# Altium schematic sheet BatTest.SchDoc
size A3
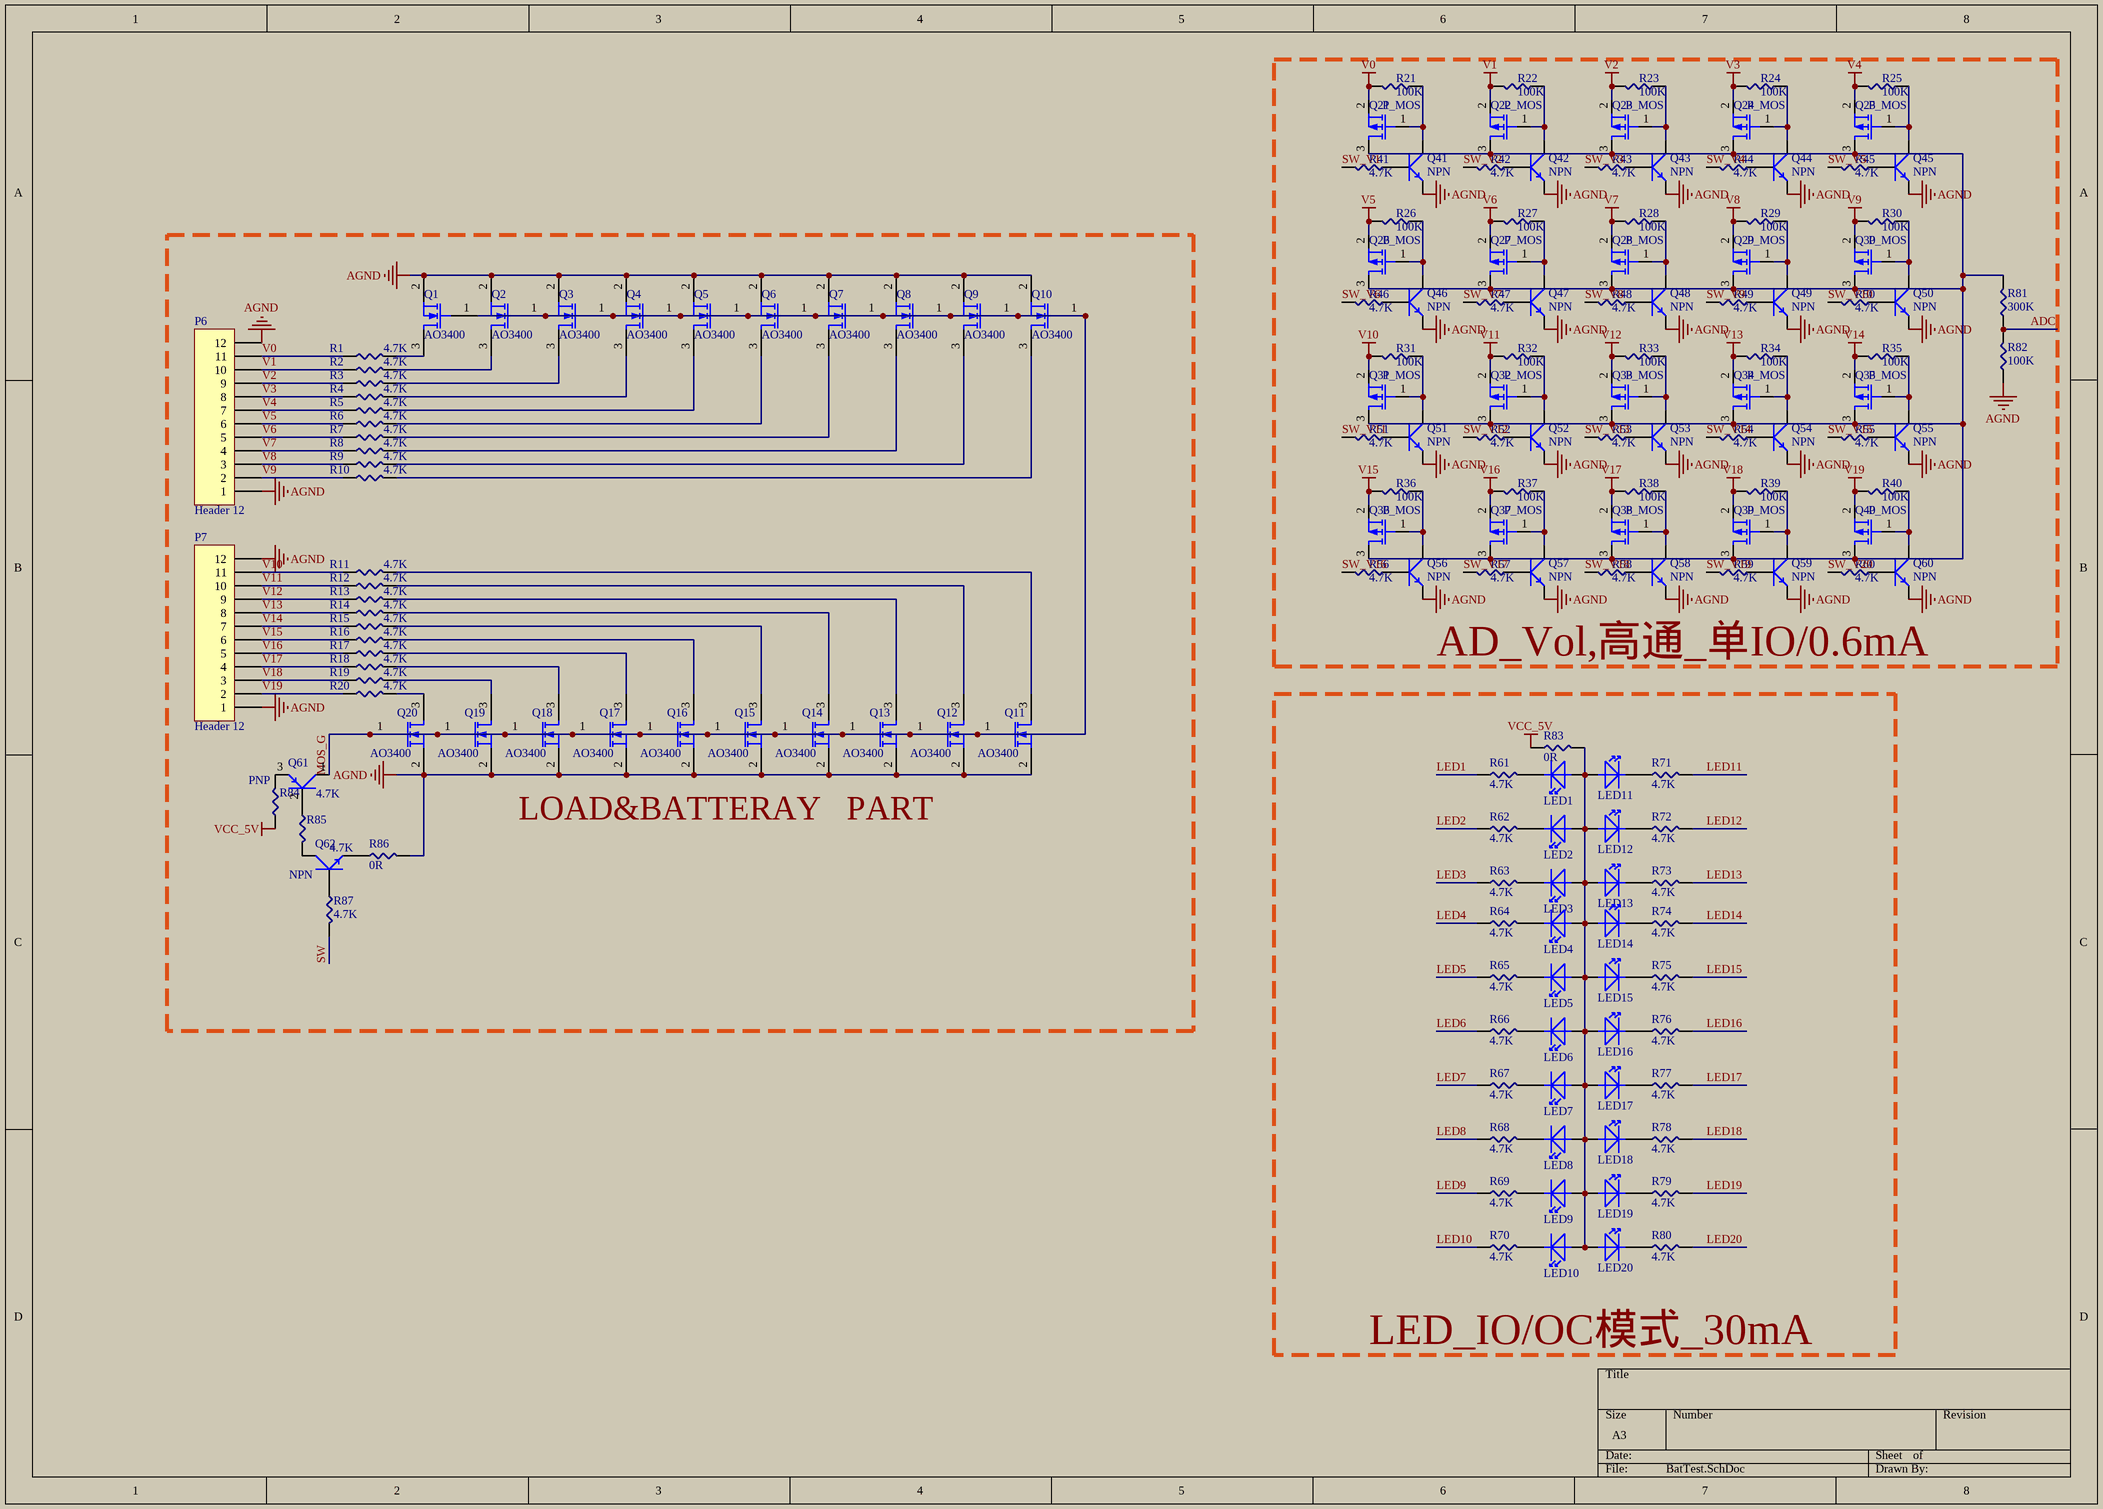
[diagram p0: BatTest.SchDoc]

## Parts
LED1  SMD-LED  [DIODE-0603]  (value not drawn)
LED2  SMD-LED  [DIODE-0603]  (value not drawn)
LED3  SMD-LED  [DIODE-0603]  (value not drawn)
LED4  SMD-LED  [DIODE-0603]  (value not drawn)
LED5  SMD-LED  [DIODE-0603]  (value not drawn)
LED6  SMD-LED  [DIODE-0603]  (value not drawn)
LED7  SMD-LED  [DIODE-0603]  (value not drawn)
LED8  SMD-LED  [DIODE-0603]  (value not drawn)
LED9  SMD-LED  [DIODE-0603]  (value not drawn)
LED10  SMD-LED  [DIODE-0603]  (value not drawn)
LED11  SMD-LED  [DIODE-0603]  (value not drawn)
LED12  SMD-LED  [DIODE-0603]  (value not drawn)
LED13  SMD-LED  [DIODE-0603]  (value not drawn)
LED14  SMD-LED  [DIODE-0603]  (value not drawn)
LED15  SMD-LED  [DIODE-0603]  (value not drawn)
LED16  SMD-LED  [DIODE-0603]  (value not drawn)
LED17  SMD-LED  [DIODE-0603]  (value not drawn)
LED18  SMD-LED  [DIODE-0603]  (value not drawn)
LED19  SMD-LED  [DIODE-0603]  (value not drawn)
LED20  SMD-LED  [DIODE-0603]  (value not drawn)
P6  Header 12  [HDR1X12]
P7  Header 12  [HDR1X12]
Q1  AO3400  [SOT-23-MOS]
Q2  AO3400  [SOT-23-MOS]
Q3  AO3400  [SOT-23-MOS]
Q4  AO3400  [SOT-23-MOS]
Q5  AO3400  [SOT-23-MOS]
Q6  AO3400  [SOT-23-MOS]
Q7  AO3400  [SOT-23-MOS]
Q8  AO3400  [SOT-23-MOS]
Q9  AO3400  [SOT-23-MOS]
Q10  AO3400  [SOT-23-MOS]
Q11  AO3400  [SOT-23-MOS]
Q12  AO3400  [SOT-23-MOS]
Q13  AO3400  [SOT-23-MOS]
Q14  AO3400  [SOT-23-MOS]
Q15  AO3400  [SOT-23-MOS]
Q16  AO3400  [SOT-23-MOS]
Q17  AO3400  [SOT-23-MOS]
Q18  AO3400  [SOT-23-MOS]
Q19  AO3400  [SOT-23-MOS]
Q20  AO3400  [SOT-23-MOS]
Q21  P_MOS  [SOT-23-MOS]
Q22  P_MOS  [SOT-23-MOS]
Q23  P_MOS  [SOT-23-MOS]
Q24  P_MOS  [SOT-23-MOS]
Q25  P_MOS  [SOT-23-MOS]
Q26  P_MOS  [SOT-23-MOS]
Q27  P_MOS  [SOT-23-MOS]
Q28  P_MOS  [SOT-23-MOS]
Q29  P_MOS  [SOT-23-MOS]
Q30  P_MOS  [SOT-23-MOS]
Q31  P_MOS  [SOT-23-MOS]
Q32  P_MOS  [SOT-23-MOS]
Q33  P_MOS  [SOT-23-MOS]
Q34  P_MOS  [SOT-23-MOS]
Q35  P_MOS  [SOT-23-MOS]
Q36  P_MOS  [SOT-23-MOS]
Q37  P_MOS  [SOT-23-MOS]
Q38  P_MOS  [SOT-23-MOS]
Q39  P_MOS  [SOT-23-MOS]
Q40  P_MOS  [SOT-23-MOS]
Q41  value NPN  [SOT-23]  (hidden comment: SMD-TRAN)
Q42  value NPN  [SOT-23]  (hidden comment: SMD-TRAN)
Q43  value NPN  [SOT-23]  (hidden comment: SMD-TRAN)
Q44  value NPN  [SOT-23]  (hidden comment: SMD-TRAN)
Q45  value NPN  [SOT-23]  (hidden comment: SMD-TRAN)
Q46  value NPN  [SOT-23]  (hidden comment: SMD-TRAN)
Q47  value NPN  [SOT-23]  (hidden comment: SMD-TRAN)
Q48  value NPN  [SOT-23]  (hidden comment: SMD-TRAN)
Q49  value NPN  [SOT-23]  (hidden comment: SMD-TRAN)
Q50  value NPN  [SOT-23]  (hidden comment: SMD-TRAN)
Q51  value NPN  [SOT-23]  (hidden comment: SMD-TRAN)
Q52  value NPN  [SOT-23]  (hidden comment: SMD-TRAN)
Q53  value NPN  [SOT-23]  (hidden comment: SMD-TRAN)
Q54  value NPN  [SOT-23]  (hidden comment: SMD-TRAN)
Q55  value NPN  [SOT-23]  (hidden comment: SMD-TRAN)
Q56  value NPN  [SOT-23]  (hidden comment: SMD-TRAN)
Q57  value NPN  [SOT-23]  (hidden comment: SMD-TRAN)
Q58  value NPN  [SOT-23]  (hidden comment: SMD-TRAN)
Q59  value NPN  [SOT-23]  (hidden comment: SMD-TRAN)
Q60  value NPN  [SOT-23]  (hidden comment: SMD-TRAN)
Q61  PNP  [SOT-23]
Q62  value NPN  [SOT-23]  (hidden comment: SMD-TRAN)
R1  value 4.7K  [C1206]  (hidden comment: Resistance)
R2  value 4.7K  [C1206]  (hidden comment: Resistance)
R3  value 4.7K  [C1206]  (hidden comment: Resistance)
R4  value 4.7K  [C1206]  (hidden comment: Resistance)
R5  value 4.7K  [C1206]  (hidden comment: Resistance)
R6  value 4.7K  [C1206]  (hidden comment: Resistance)
R7  value 4.7K  [C1206]  (hidden comment: Resistance)
R8  value 4.7K  [C1206]  (hidden comment: Resistance)
R9  value 4.7K  [C1206]  (hidden comment: Resistance)
R10  value 4.7K  [C1206]  (hidden comment: Resistance)
R11  value 4.7K  [C1206]  (hidden comment: Resistance)
R12  value 4.7K  [C1206]  (hidden comment: Resistance)
R13  value 4.7K  [C1206]  (hidden comment: Resistance)
R14  value 4.7K  [C1206]  (hidden comment: Resistance)
R15  value 4.7K  [C1206]  (hidden comment: Resistance)
R16  value 4.7K  [C1206]  (hidden comment: Resistance)
R17  value 4.7K  [C1206]  (hidden comment: Resistance)
R18  value 4.7K  [C1206]  (hidden comment: Resistance)
R19  value 4.7K  [C1206]  (hidden comment: Resistance)
R20  value 4.7K  [C1206]  (hidden comment: Resistance)
R21  value 100K  [R_0603]  (hidden comment: Resistance)
R22  value 100K  [R_0603]  (hidden comment: Resistance)
R23  value 100K  [R_0603]  (hidden comment: Resistance)
R24  value 100K  [R_0603]  (hidden comment: Resistance)
R25  value 100K  [R_0603]  (hidden comment: Resistance)
R26  value 100K  [R_0603]  (hidden comment: Resistance)
R27  value 100K  [R_0603]  (hidden comment: Resistance)
R28  value 100K  [R_0603]  (hidden comment: Resistance)
R29  value 100K  [R_0603]  (hidden comment: Resistance)
R30  value 100K  [R_0603]  (hidden comment: Resistance)
R31  value 100K  [R_0603]  (hidden comment: Resistance)
R32  value 100K  [R_0603]  (hidden comment: Resistance)
R33  value 100K  [R_0603]  (hidden comment: Resistance)
R34  value 100K  [R_0603]  (hidden comment: Resistance)
R35  value 100K  [R_0603]  (hidden comment: Resistance)
R36  value 100K  [R_0603]  (hidden comment: Resistance)
R37  value 100K  [R_0603]  (hidden comment: Resistance)
R38  value 100K  [R_0603]  (hidden comment: Resistance)
R39  value 100K  [R_0603]  (hidden comment: Resistance)
R40  value 100K  [R_0603]  (hidden comment: Resistance)
R41  value 4.7K  [R_0603]  (hidden comment: Resistance)
R42  value 4.7K  [R_0603]  (hidden comment: Resistance)
R43  value 4.7K  [R_0603]  (hidden comment: Resistance)
R44  value 4.7K  [R_0603]  (hidden comment: Resistance)
R45  value 4.7K  [R_0603]  (hidden comment: Resistance)
R46  value 4.7K  [R_0603]  (hidden comment: Resistance)
R47  value 4.7K  [R_0603]  (hidden comment: Resistance)
R48  value 4.7K  [R_0603]  (hidden comment: Resistance)
R49  value 4.7K  [R_0603]  (hidden comment: Resistance)
R50  value 4.7K  [R_0603]  (hidden comment: Resistance)
R51  value 4.7K  [R_0603]  (hidden comment: Resistance)
R52  value 4.7K  [R_0603]  (hidden comment: Resistance)
R53  value 4.7K  [R_0603]  (hidden comment: Resistance)
R54  value 4.7K  [R_0603]  (hidden comment: Resistance)
R55  value 4.7K  [R_0603]  (hidden comment: Resistance)
R56  value 4.7K  [R_0603]  (hidden comment: Resistance)
R57  value 4.7K  [R_0603]  (hidden comment: Resistance)
R58  value 4.7K  [R_0603]  (hidden comment: Resistance)
R59  value 4.7K  [R_0603]  (hidden comment: Resistance)
R60  value 4.7K  [R_0603]  (hidden comment: Resistance)
R61  value 4.7K  [R_0603]  (hidden comment: Resistance)
R62  value 4.7K  [R_0603]  (hidden comment: Resistance)
R63  value 4.7K  [R_0603]  (hidden comment: Resistance)
R64  value 4.7K  [R_0603]  (hidden comment: Resistance)
R65  value 4.7K  [R_0603]  (hidden comment: Resistance)
R66  value 4.7K  [R_0603]  (hidden comment: Resistance)
R67  value 4.7K  [R_0603]  (hidden comment: Resistance)
R68  value 4.7K  [R_0603]  (hidden comment: Resistance)
R69  value 4.7K  [R_0603]  (hidden comment: Resistance)
R70  value 4.7K  [R_0603]  (hidden comment: Resistance)
R71  value 4.7K  [R_0603]  (hidden comment: Resistance)
R72  value 4.7K  [R_0603]  (hidden comment: Resistance)
R73  value 4.7K  [R_0603]  (hidden comment: Resistance)
R74  value 4.7K  [R_0603]  (hidden comment: Resistance)
R75  value 4.7K  [R_0603]  (hidden comment: Resistance)
R76  value 4.7K  [R_0603]  (hidden comment: Resistance)
R77  value 4.7K  [R_0603]  (hidden comment: Resistance)
R78  value 4.7K  [R_0603]  (hidden comment: Resistance)
R79  value 4.7K  [R_0603]  (hidden comment: Resistance)
R80  value 4.7K  [R_0603]  (hidden comment: Resistance)
R81  value 300K  [R_0603]  (hidden comment: Resistance)
R82  value 100K  [R_0603]  (hidden comment: Resistance)
R83  value 0R  [R_0603]  (hidden comment: Resistance)
R84  value 4.7K  [R_0603]  (hidden comment: Resistance)
R85  value 4.7K  [R_0603]  (hidden comment: Resistance)
R86  value 0R  [R_0603]  (hidden comment: Resistance)
R87  value 4.7K  [R_0603]  (hidden comment: Resistance)

## Blocks framed on the sheet
AD_Vol,高通_单IO/0.6mA: Q21-Q60 R21-R60 R81 R82
LOAD&BATTERAY   PART: P6 P7 Q1-Q20 Q61 Q62 R1-R20 R84-R87
LED_IO/OC模式_30mA: LED1-LED20 R61-R80 R83

## Nets
AGND: P6.1 P6.12 P7.1 P7.12 Q1.2(S) Q2.2(S) Q3.2(S) Q4.2(S) Q5.2(S) Q6.2(S) Q7.2(S) Q8.2(S) Q9.2(S) Q10.2(S) Q11.2(S) Q12.2(S) Q13.2(S) Q14.2(S) Q15.2(S) Q16.2(S) Q17.2(S) Q18.2(S) Q19.2(S) Q20.2(S) Q41.3(e) Q42.3(e) Q43.3(e) Q44.3(e) Q45.3(e) Q46.3(e) Q47.3(e) Q48.3(e) Q49.3(e) Q50.3(e) Q51.3(e) Q52.3(e) Q53.3(e) Q54.3(e) Q55.3(e) Q56.3(e) Q57.3(e) Q58.3(e) Q59.3(e) Q60.3(e) R82.1 R86.2
V0: P6.11 Q21.2(S) R1.1 R21.2
V1: P6.10 Q22.2(S) R2.1 R22.2
V2: P6.9 Q23.2(S) R3.1 R23.2
V3: P6.8 Q24.2(S) R4.1 R24.2
V4: P6.7 Q25.2(S) R5.1 R25.2
V5: P6.6 Q26.2(S) R6.1 R26.2
V6: P6.5 Q27.2(S) R7.1 R27.2
V7: P6.4 Q28.2(S) R8.1 R28.2
V8: P6.3 Q29.2(S) R9.1 R29.2
V9: P6.2 Q30.2(S) R10.1 R30.2
V10: P7.11 Q31.2(S) R11.1 R31.2
V11: P7.10 Q32.2(S) R12.1 R32.2
V12: P7.9 Q33.2(S) R13.1 R33.2
V13: P7.8 Q34.2(S) R14.1 R34.2
V14: P7.7 Q35.2(S) R15.1 R35.2
V15: P7.6 Q36.2(S) R16.1 R36.2
V16: P7.5 Q37.2(S) R17.1 R37.2
V17: P7.4 Q38.2(S) R18.1 R38.2
V18: P7.3 Q39.2(S) R19.1 R39.2
V19: P7.2 Q40.2(S) R20.1 R40.2
VCC_5V: R83.1 R84.1
ADC: R81.1 R82.2
LED1: R61.1
LED2: R62.1
LED3: R63.1
LED4: R64.1
LED5: R65.1
LED6: R66.1
LED7: R67.1
LED8: R68.1
LED9: R69.1
LED10: R70.1
LED11: R71.2
LED12: R72.2
LED13: R73.2
LED14: R74.2
LED15: R75.2
LED16: R76.2
LED17: R77.2
LED18: R78.2
LED19: R79.2
LED20: R80.2
SW: R87.2
SW_V1: R41.2
SW_V2: R42.2
SW_V3: R43.2
SW_V4: R44.2
SW_V5: R45.2
SW_V6: R46.2
SW_V7: R47.2
SW_V8: R48.2
SW_V9: R49.2
SW_V10: R50.2
SW_V11: R51.2
SW_V12: R52.2
SW_V13: R53.2
SW_V14: R54.2
SW_V15: R55.2
SW_V16: R56.2
SW_V17: R57.2
SW_V18: R58.2
SW_V19: R59.2
SW_V20: R60.2
NetLED1_1: LED1.1(A) LED2.1(A) LED3.1(A) LED4.1(A) LED5.1(A) LED6.1(A) LED7.1(A) LED8.1(A) LED9.1(A) LED10.1(A) LED11.1(A) LED12.1(A) LED13.1(A) LED14.1(A) LED15.1(A) LED16.1(A) LED17.1(A) LED18.1(A) LED19.1(A) LED20.1(A) R83.2
NetLED1_2: LED1.2(K) R61.2
NetLED2_2: LED2.2(K) R62.2
NetLED3_2: LED3.2(K) R63.2
NetLED4_2: LED4.2(K) R64.2
NetLED5_2: LED5.2(K) R65.2
NetLED6_2: LED6.2(K) R66.2
NetLED7_2: LED7.2(K) R67.2
NetLED8_2: LED8.2(K) R68.2
NetLED9_2: LED9.2(K) R69.2
NetLED10_2: LED10.2(K) R70.2
NetLED11_2: LED11.2(K) R71.1
NetLED12_2: LED12.2(K) R72.1
NetLED13_2: LED13.2(K) R73.1
NetLED14_2: LED14.2(K) R74.1
NetLED15_2: LED15.2(K) R75.1
NetLED16_2: LED16.2(K) R76.1
NetLED17_2: LED17.2(K) R77.1
NetLED18_2: LED18.2(K) R78.1
NetLED19_2: LED19.2(K) R79.1
NetLED20_2: LED20.2(K) R80.1
NetQ1_1: Q1.1(G) Q2.1(G) Q3.1(G) Q4.1(G) Q5.1(G) Q6.1(G) Q7.1(G) Q8.1(G) Q9.1(G) Q10.1(G) Q11.1(G) Q12.1(G) Q13.1(G) Q14.1(G) Q15.1(G) Q16.1(G) Q17.1(G) Q18.1(G) Q19.1(G) Q20.1(G) Q61.1(c)
NetQ1_3: Q1.3(D) R1.2
NetQ2_3: Q2.3(D) R2.2
NetQ3_3: Q3.3(D) R3.2
NetQ4_3: Q4.3(D) R4.2
NetQ5_3: Q5.3(D) R5.2
NetQ6_3: Q6.3(D) R6.2
NetQ7_3: Q7.3(D) R7.2
NetQ8_3: Q8.3(D) R8.2
NetQ9_3: Q9.3(D) R9.2
NetQ10_3: Q10.3(D) R10.2
NetQ11_3: Q11.3(D) R11.2
NetQ12_3: Q12.3(D) R12.2
NetQ13_3: Q13.3(D) R13.2
NetQ14_3: Q14.3(D) R14.2
NetQ15_3: Q15.3(D) R15.2
NetQ16_3: Q16.3(D) R16.2
NetQ17_3: Q17.3(D) R17.2
NetQ18_3: Q18.3(D) R18.2
NetQ19_3: Q19.3(D) R19.2
NetQ20_3: Q20.3(D) R20.2
NetQ21_1: Q21.1(G) Q41.1(c) R21.1
NetQ21_3: Q21.3(D) Q22.3(D) Q23.3(D) Q24.3(D) Q25.3(D) Q26.3(D) Q27.3(D) Q28.3(D) Q29.3(D) Q30.3(D) Q31.3(D) Q32.3(D) Q33.3(D) Q34.3(D) Q35.3(D) Q36.3(D) Q37.3(D) Q38.3(D) Q39.3(D) Q40.3(D) R81.2
NetQ22_1: Q22.1(G) Q42.1(c) R22.1
NetQ23_1: Q23.1(G) Q43.1(c) R23.1
NetQ24_1: Q24.1(G) Q44.1(c) R24.1
NetQ25_1: Q25.1(G) Q45.1(c) R25.1
NetQ26_1: Q26.1(G) Q46.1(c) R26.1
NetQ27_1: Q27.1(G) Q47.1(c) R27.1
NetQ28_1: Q28.1(G) Q48.1(c) R28.1
NetQ29_1: Q29.1(G) Q49.1(c) R29.1
NetQ30_1: Q30.1(G) Q50.1(c) R30.1
NetQ31_1: Q31.1(G) Q51.1(c) R31.1
NetQ32_1: Q32.1(G) Q52.1(c) R32.1
NetQ33_1: Q33.1(G) Q53.1(c) R33.1
NetQ34_1: Q34.1(G) Q54.1(c) R34.1
NetQ35_1: Q35.1(G) Q55.1(c) R35.1
NetQ36_1: Q36.1(G) Q56.1(c) R36.1
NetQ37_1: Q37.1(G) Q57.1(c) R37.1
NetQ38_1: Q38.1(G) Q58.1(c) R38.1
NetQ39_1: Q39.1(G) Q59.1(c) R39.1
NetQ40_1: Q40.1(G) Q60.1(c) R40.1
NetQ41_2: Q41.2(b) R41.1
NetQ42_2: Q42.2(b) R42.1
NetQ43_2: Q43.2(b) R43.1
NetQ44_2: Q44.2(b) R44.1
NetQ45_2: Q45.2(b) R45.1
NetQ46_2: Q46.2(b) R46.1
NetQ47_2: Q47.2(b) R47.1
NetQ48_2: Q48.2(b) R48.1
NetQ49_2: Q49.2(b) R49.1
NetQ50_2: Q50.2(b) R50.1
NetQ51_2: Q51.2(b) R51.1
NetQ52_2: Q52.2(b) R52.1
NetQ53_2: Q53.2(b) R53.1
NetQ54_2: Q54.2(b) R54.1
NetQ55_2: Q55.2(b) R55.1
NetQ56_2: Q56.2(b) R56.1
NetQ57_2: Q57.2(b) R57.1
NetQ58_2: Q58.2(b) R58.1
NetQ59_2: Q59.2(b) R59.1
NetQ60_2: Q60.2(b) R60.1
NetQ61_2: Q61.2(b) R85.1
NetQ61_3: Q61.3(e) R84.2
NetQ62_1: Q62.1(c) R85.2
NetQ62_2: Q62.2(b) R87.1
NetQ62_3: Q62.3(e) R86.1

## Notes on the sheet
- Labels drawn without touching a wire or pin: MOS_G

## Library data of the parts
LED1-LED20 = LED: Value: LED
P6 P7 = Header 12: Header, 12-Pin; LatestRevisionDate: 17-Jul-2002; LatestRevisionNote: Re-released for DXP Platform.; Publisher: Altium Limited
Q1-Q20 = N_MOS
Q41-Q60 Q62 = NPN: S8550-J3Y
Q61 = PNP: Value: 8550
R1-R87 = Resistance: Power Resistance